# EAGLE schematic dataloggerver2.0 (EAGLE 9.6.2)
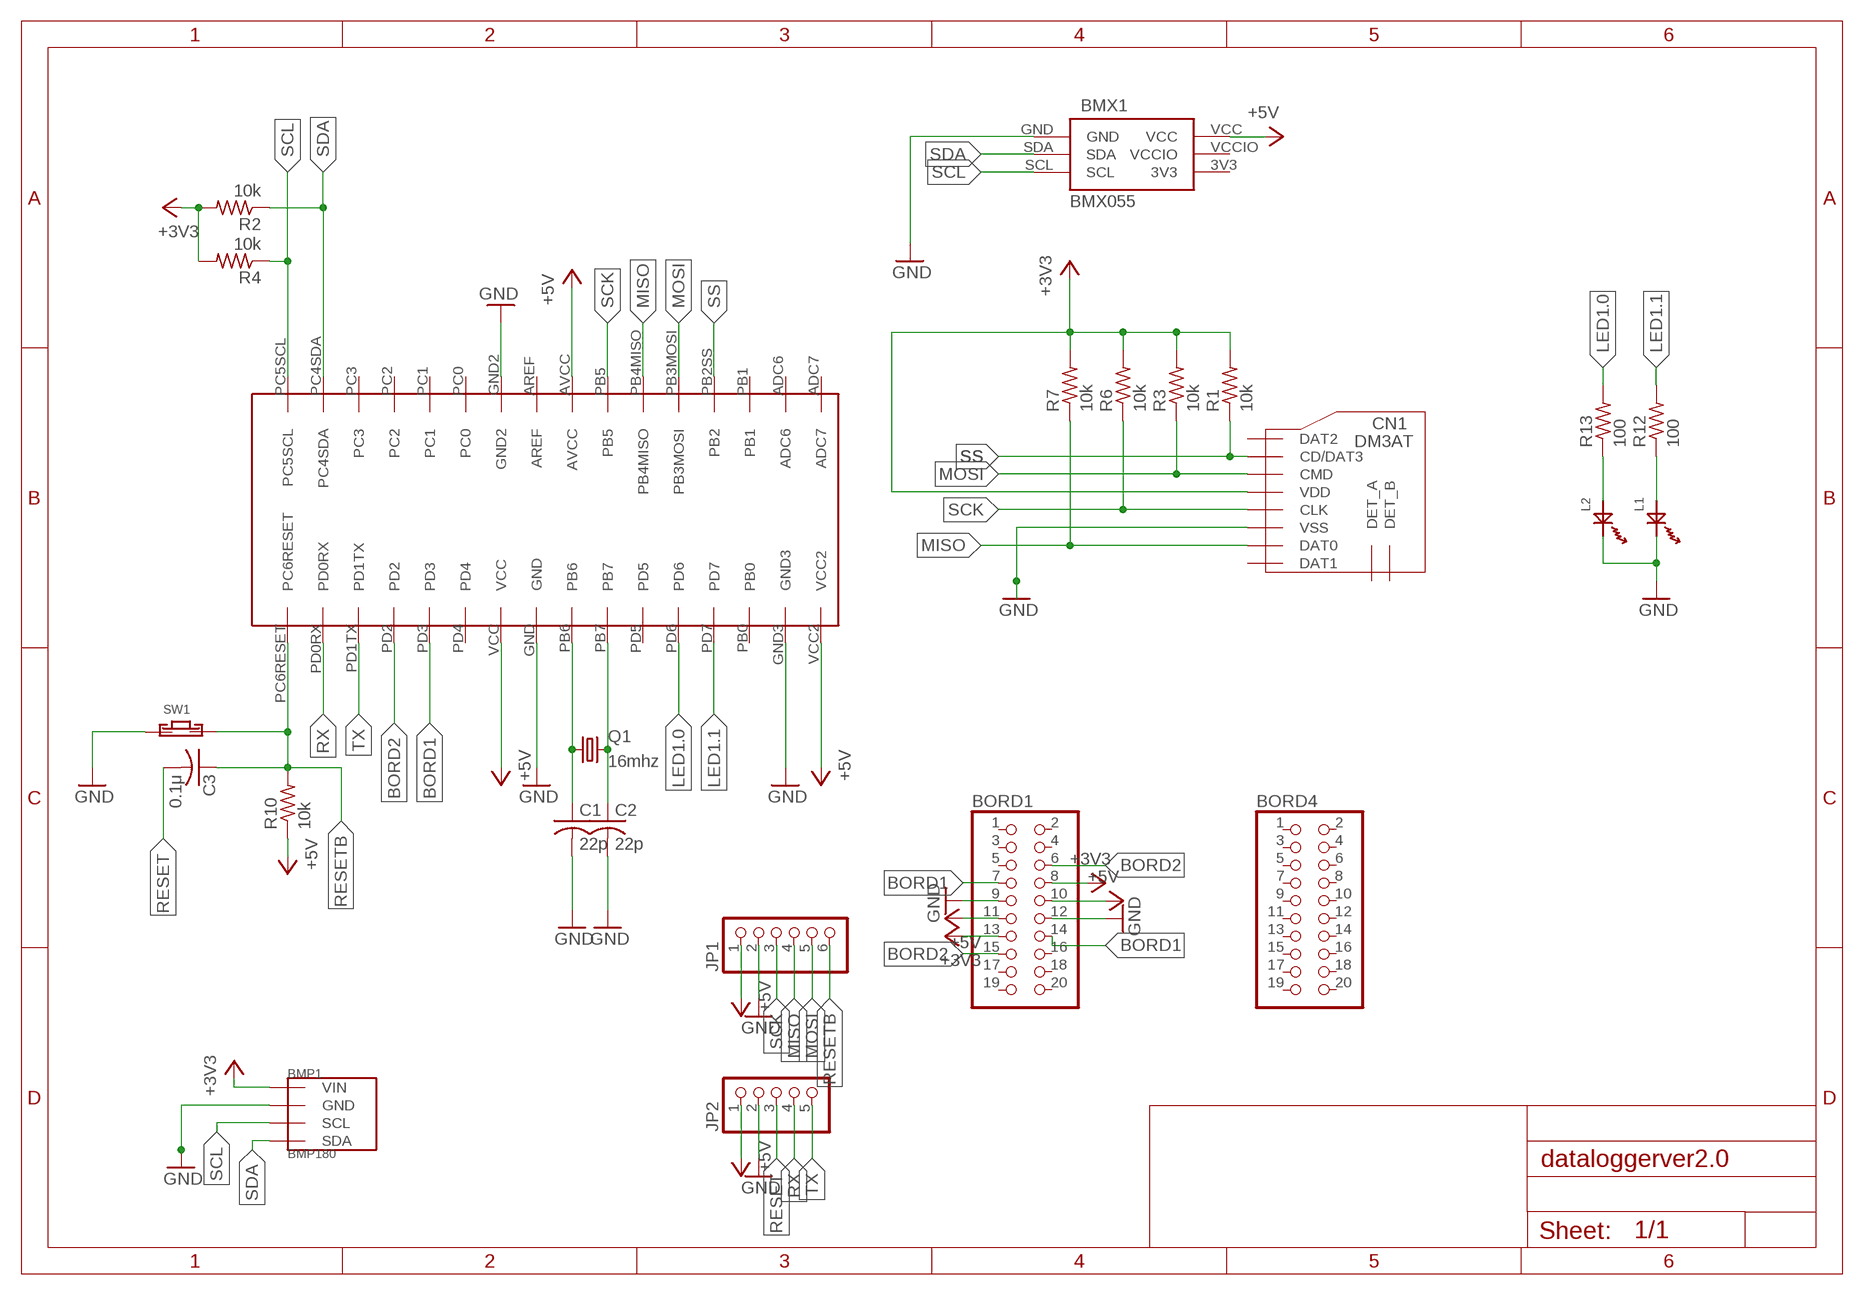
[diagram p0: schematic, sheet 1]

## Parts
BMP1  BMP180  [GY-68]
BMX1  BMX055  [BMX055]
BORD1  PINHD-2X10/90  [2X10/90]
BORD4  PINHD-2X10/90  [2X10/90]
C1  22p  C-USC1608  [C1608]
C2  22p  C-USC1608  [C1608]
C3  0.1μ  C-USC1608  [C1608]
CN1  DM3AT  [DM3AT]
JP1  PINHD-1X6  [1X06]
JP2  PINHD-1X5  [1X05]
L1  OSXX1608C1A  [OSXX1608C1A]
L2  OSXX1608C1A  [OSXX1608C1A]
Q1  16mhz  CRYSTALHC49UP  [HC49UP]
R1  10k  R-US_R0603  [R0603]
R2  10k  R-US_R0603  [R0603]
R3  10k  R-US_R0603  [R0603]
R4  10k  R-US_R0603  [R0603]
R6  10k  R-US_R0603  [R0603]
R7  10k  R-US_R0603  [R0603]
R10  10k  R-US_R0603  [R0603]
R12  100  R-US_R0603  [R0603]
R13  100  R-US_R0603  [R0603]
SW1  TVAF06-A020B-R  [TVAF06-A020B-R]
U$1  ATMEGA328P-AU  [QFP80P900X900X120-32N]

## Nets
+3V3: BMP1.P1(VIN) BORD1.8 BORD1.13 CN1.VDD R1.2 R2.2 R3.2 R4.2 R6.2 R7.2
+5V: BMX1.VCC BORD1.10 BORD1.11 JP1.1 JP2.1 R10.1 U$1.AVCC U$1.VCC U$1.VCC2
BORD1: BORD1.7 BORD1.14 U$1.PD3
BORD2: BORD1.6 BORD1.15 U$1.PD2
GND: BMP1.P2(GND) BMX1.GND BORD1.9 BORD1.12 C1.2 C2.2 CN1.VSS JP1.2 JP2.2 L1.CT L2.CT SW1.P$1 U$1.GND U$1.GND2 U$1.GND3
LED1.0: R13.2 U$1.PD6
LED1.1: R12.2 U$1.PD7
MISO: CN1.DAT0 JP1.4 R7.1 U$1.PB4MISO
MOSI: CN1.CMD JP1.5 R3.1 U$1.PB3MOSI
N$1: L2.AN R13.1
N$7: L1.AN R12.1
N$12: C1.1 Q1.1 U$1.PB6
N$13: C2.1 Q1.2 U$1.PB7
RESET: C3.2 JP2.3
RESETB: C3.1 JP1.6 R10.2 SW1.P$2 U$1.PC6RESET
RX: JP2.4 U$1.PD0RX
SCK: CN1.CLK JP1.3 R6.1 U$1.PB5
SCL: BMP1.P3(SCL) BMX1.SCL R4.1 U$1.PC5SCL
SDA: BMP1.P4(SDA) BMX1.SDA R2.1 U$1.PC4SDA
SS: CN1.CD/DAT3 R1.1 U$1.PB2SS(PB2)
TX: JP2.5 U$1.PD1TX
Unconnected: BORD1.1 BORD1.2 BORD1.3 BORD1.4 BORD1.5 BORD1.16 BORD1.17 BORD1.18 BORD1.19 BORD1.20 BORD4.1 BORD4.2 BORD4.3 BORD4.4 BORD4.5 BORD4.6 BORD4.7 BORD4.8 BORD4.9 BORD4.10 BORD4.11 BORD4.12 BORD4.13 BORD4.14 BORD4.15 BORD4.16 BORD4.17 BORD4.18 BORD4.19 BORD4.20 CN1.DAT1 CN1.DAT2 CN1.DET_A CN1.DET_B U$1.ADC6 U$1.ADC7 U$1.AREF U$1.PB0 U$1.PB1 U$1.PC0 U$1.PC1 U$1.PC2 U$1.PC3 U$1.PD4 U$1.PD5

## Power pins joined to a net without a drawn wire
3V3: BMX1.3V3
VCCIO: BMX1.VCCIO

## Library data of the parts
BMP1 = BMP180:BMP180
BMX1 = BMX055:BMX055
BORD1 BORD4 = pinhead:PINHD-2X10: PIN HEADER
C1-C3 = rcl:C-US: CAPACITOR, American symbol; SPICEPREFIX: C
CN1 = microSD:DM3AT
JP1 = pinhead:PINHD-1X6: PIN HEADER
JP2 = pinhead:PINHD-1X5: PIN HEADER
L1 L2 = Chip LED:OSXX1608C1A
Q1 = crystal:CRYSTAL: CRYSTAL; OC_FARNELL: unknown; OC_NEWARK: unknown
R1-R4 R6 R7 R10 R12 R13 = rcl:R-US_: RESISTOR, American symbol; SPICEPREFIX: R
SW1 = Tact switch:TVAF06-A020B-R
U$1 = ATMAGA328P-AU:ATMEGA328P-AU

## Net classes
0 default: width 0.406 mm